# Altium schematic sheet PressureSensors.SchDoc
size A
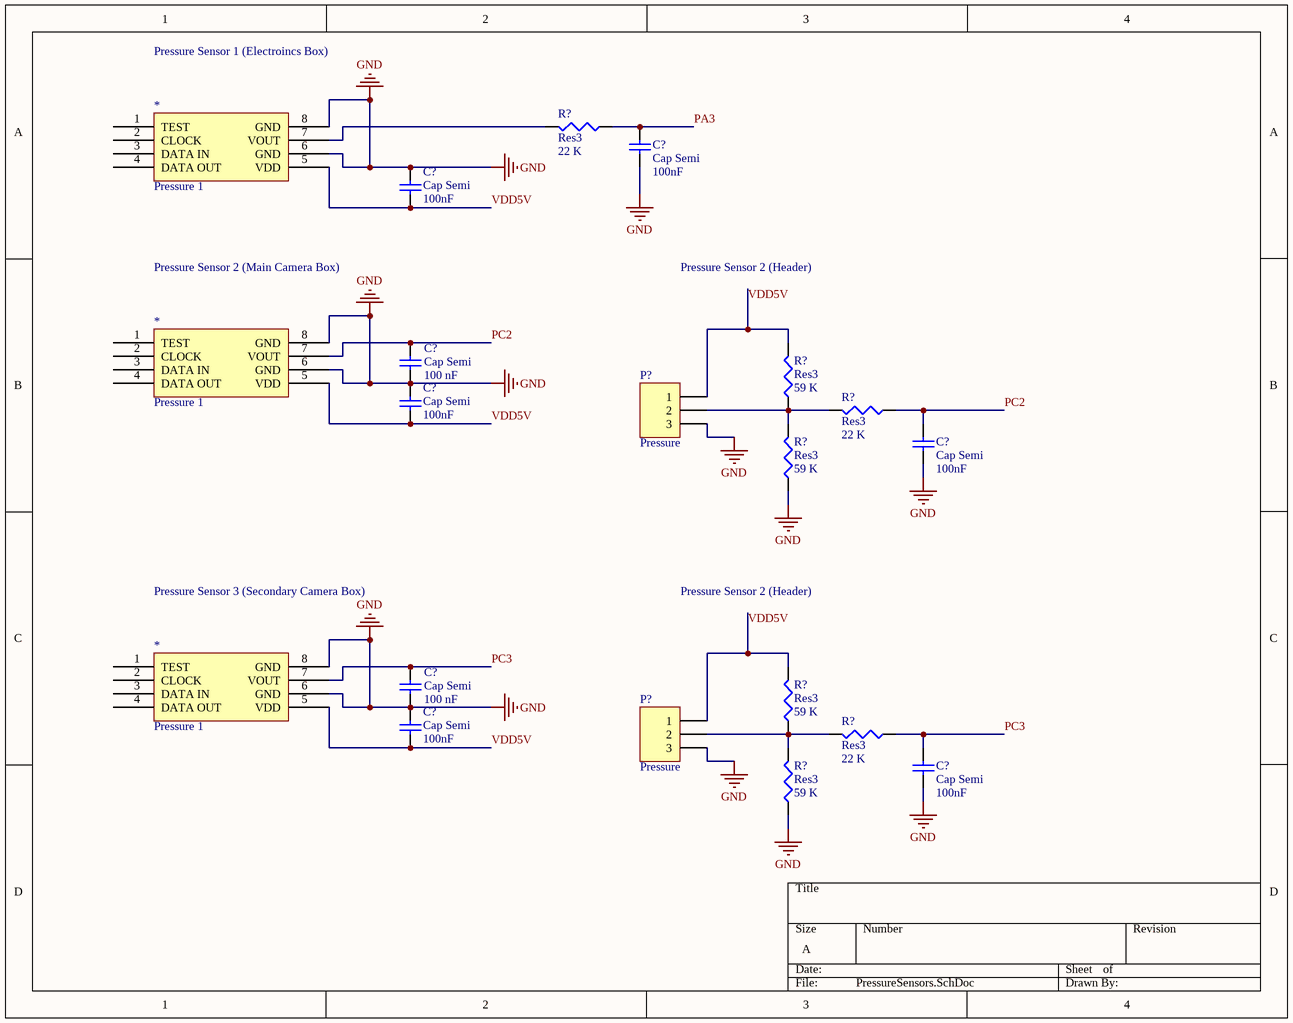
[diagram p0: PressureSensors.SchDoc]

## Parts
(Parts that share a designator on the sheet are numbered #1, #2 ... from top to bottom, then left to right.)
*#1  Pressure 1
*#2  Pressure 1
*#3  Pressure 1
C?#1  Cap Semi  value 100nF  [C1206]
C?#2  Cap Semi  value 100nF  [C1206]
C?#3  Cap Semi  value 100 nF  [C1206]
C?#4  Cap Semi  value 100nF  [C1206]
C?#5  Cap Semi  value 100nF  [C1206]
C?#6  Cap Semi  value 100 nF  [C1206]
C?#7  Cap Semi  value 100nF  [C1206]
C?#8  Cap Semi  value 100nF  [C1206]
P?#1  Pressure  [HDR1X3]
P?#2  Pressure  [HDR1X3]
R?#1  Res3  value 22 K  [14-1210]
R?#2  Res3  value 59 K  [14-1210]
R?#3  Res3  value 22 K  [14-1210]
R?#4  Res3  value 59 K  [14-1210]
R?#5  Res3  value 59 K  [14-1210]
R?#6  Res3  value 22 K  [14-1210]
R?#7  Res3  value 59 K  [14-1210]

## Nets
GND: *#1.6(GND) *#1.8(GND) *#2.6(GND) *#2.8(GND) *#3.6(GND) *#3.8(GND) C?#1.1 C?#2.2 C?#3.1 C?#4.2 C?#5.1 C?#6.1 C?#7.2 C?#8.1 P?#1.3 P?#2.3 R?#4.1 R?#7.1
PA3: C?#1.2 R?#1.1
PC2: *#2.7(VOUT) C?#3.2 C?#5.2 R?#3.1
PC3: *#3.7(VOUT) C?#6.2 C?#8.2 R?#6.1
VDD5V: *#1.5(VDD) *#2.5(VDD) *#3.5(VDD) C?#2.1 C?#4.1 C?#7.1 P?#1.1 P?#2.1 R?#2.2 R?#5.2
Net*#1_7: *#1.7(VOUT) R?#1.2
NetP?#1_2: P?#1.2 R?#2.1 R?#3.2 R?#4.2
NetP?#2_2: P?#2.2 R?#5.1 R?#6.2 R?#7.2

Not connected (* = marked no-connect by the designer): *#1 1(TEST) 2(CLOCK) 3(DATA_IN) 4(DATA_OUT); *#2 1(TEST) 2(CLOCK) 3(DATA_IN) 4(DATA_OUT); *#3 1(TEST) 2(CLOCK) 3(DATA_IN) 4(DATA_OUT)

## Notes on the sheet
- Pressure Sensor 1 (Electroincs Box)
- Pressure Sensor 2 (Main Camera Box)
- Pressure Sensor 2 (Header)
- Pressure Sensor 3 (Secondary Camera Box)

## Library data of the parts
*#1-*#3 = Component_1
C?#1-C?#8 = Cap Semi: Capacitor (Semiconductor SIM Model); Published: 8-Jun-2000; LatestRevisionDate: 29-May-2009; LatestRevisionNote: IPC-7351 Footprint Added.; PackageReference: C1206; Publisher: Altium Limited; PackageDescription: Chip Capacitor
P?#1 P?#2 = Header 3: Header, 3-Pin; LatestRevisionDate: 17-Jul-2002; LatestRevisionNote: Re-released for DXP Platform.; Publisher: Altium Limited
R?#1-R?#7 = Res3: Resistor; Published: 8-Jun-2000; LatestRevisionDate: 29-May-2009; LatestRevisionNote: IPC-7351 Footprint Added.; PackageReference: J1-0603; Publisher: Altium Limited; PackageDescription: Chip Resistor